# Altium schematic sheet Power.SchDoc
size A; SheetNumber: 3; SheetTotal: 3
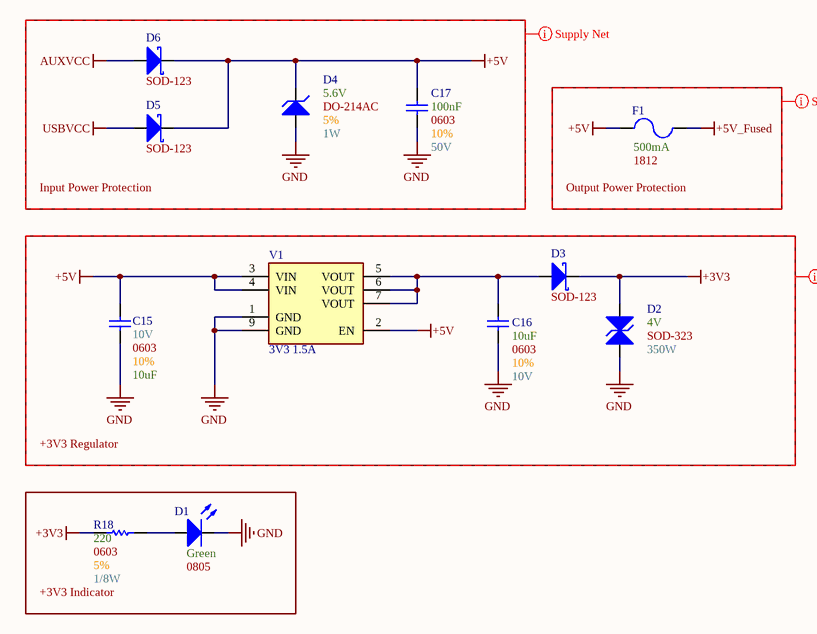
[diagram p0: Power.SchDoc]

## Parts
C15  Max Voltage: 10V  Size Package: 0603  Tolerance: 10%  Capacitance: 10uF  [[Cap] SMD 0603]  (hidden comment: [Cap] 0603 10uF 10% 10V)
C16  Max Voltage: 10V  Size Package: 0603  Tolerance: 10%  Capacitance: 10uF  [[Cap] SMD 0603]  (hidden comment: [Cap] 0603 10uF 10% 10V)
C17  Max Voltage: 50V  Size Package: 0603  Tolerance: 10%  Capacitance: 100nF  [[Cap] SMD 0603]  (hidden comment: [Cap] 0603 0.1uF 10% 50V)
D1  Color: Green  Size Package: 0805  [[LED] SMD 0805]  (hidden comment: [LED] SMD 0805 Green)
D2  Wattage: 350W  Optimal Zener Voltage: 4V  [[Diode] SOD-323]  (hidden comment: SOD-323)
D3  Footprint: SOD-123  [[Diode] SMD SOD-123]  (hidden comment: SOD123)
D4  Tolerance: 5%  Wattage: 1W  Optimal Zener Voltage: 5.6V  [[Diode] SMD DO-214AC]  (hidden comment: DO-214AC)
D5  Footprint: SOD-123  [[Diode] SMD SOD-123]  (hidden comment: SOD123)
D6  Footprint: SOD-123  [[Diode] SMD SOD-123]  (hidden comment: SOD123)
F1  Size Package: 1812  Trip Current: 500mA  [[PTC] SMD 1812]  (hidden comment: [PTC] SMD 1812 500mA)
R18  Wattage: 1/8W  Tolerance: 5%  Resistance: 220  Size Package: 0603  [[Res] SMD 0603]  (hidden comment: [220] SMD 0603 5% 1/10W)
V1  3V3 1.5A  [[Linear] 3V3 1.5A]

## Blocks framed on the sheet
Input Power Protection: C17 D4-D6
Output Power Protection: F1
+3V3 Regulator: C15 C16 D2 D3 V1
+3V3 Indicator: D1 R18

## Nets
+3V3: D2.1(K) D3.1(K) R18.1
+5V: C15.2 C17.2 D4.1(K) D5.1(K) D6.1(K) F1.1 V1.2(EN) V1.3(VIN) V1.4(VIN)
+5V_Fused: F1.2
AUXVCC: D6.2(A)
GND: C15.1 C16.1 C17.1 D1.2(Cathode) D2.2(A) D4.2(A) V1.1(GND) V1.9(GND)
USBVCC: D5.2(A)
NetC16_2: C16.2 D3.2(A) V1.5(VOUT) V1.6(VOUT) V1.7(VOUT)
NetD1_1: D1.1(Anode) R18.2

## Layout directives
net class Supply_Nets: +3V3, +5V, +5V_Fused, AUXVCC, GND, USBVCC

## Library data of the parts
C15 C16 = [Cap] 0603 10uF 10% 10V: CL10A106KP8NNNC; Supplier 1: DigiKey; Supplier Part Number 1: 1276-1192-6-ND
C17 = [Cap] 0603 0.1uF 10% 50V: CL10B104KB8NNNC; Supplier 1: DigiKey; Supplier Part Number 1: 1276-1000-6-ND
D1 = [LED] SMD 0805 Green: LG R971-KN-1-0-20-R18; Supplier 1: DigiKey; Supplier Part Number 1: 475-LGR971-KN-1CT-ND
D2 = [TVS] 3.3Vnom 19Vclamp_max: CDSOD323-T03C; Supplier 1: DigiKey; Footprint: SOD-323; Supplier Part Number 1: CDSOD323-T03CDKR-ND
D3 D5 D6 = [Schottky] SMD 40V 1A: B5819W-TP; Supplier 1: DigiKey; Supplier Part Number 1: B5819W-TPMSCT-ND
D4 = [Zener] SMD 5.6V 1W 5%: SMAZ5V6-13-F; Supplier 1: DigiKey; Supplier Part Number 1: SMAZ5V6-FDICT-ND; Footprint: DO-214AC
F1 = [PTC] SMD 1812 500mA: MF-MSMF050-2; Supplier 1: DigiKey; Supplier Part Number 1: MF-MSMF050-2DKR-ND
R18 = [220] SMD 0603 5% 1/10W: RK73B1JTTD221J; Supplier 1: DigiKey; Supplier Part Number 1: 2019-RK73B1JTTD221JDKR-ND
V1 = [Linear] SMD 3V3 1.5A: AP7362A-33SP-13; Supplier 1: DigiKey; Supplier Part Number 1: AP7362A-33SP-13DICT-ND